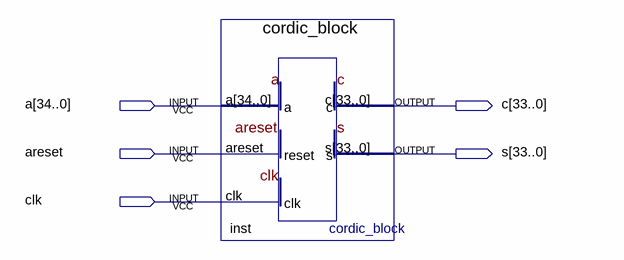
[diagram p0: schematic sheet]
// Quartus schematic sincos_cordic.bdf as structural Verilog: 1 symbols, 5 pins
module sincos_cordic (
  input  [34:0] a,
  input  areset,
  input  clk,
  output [33:0] c,
  output [33:0] s
);

  cordic_block inst (.a(a), .areset(areset), .clk(clk), .c(c), .s(s));
endmodule
